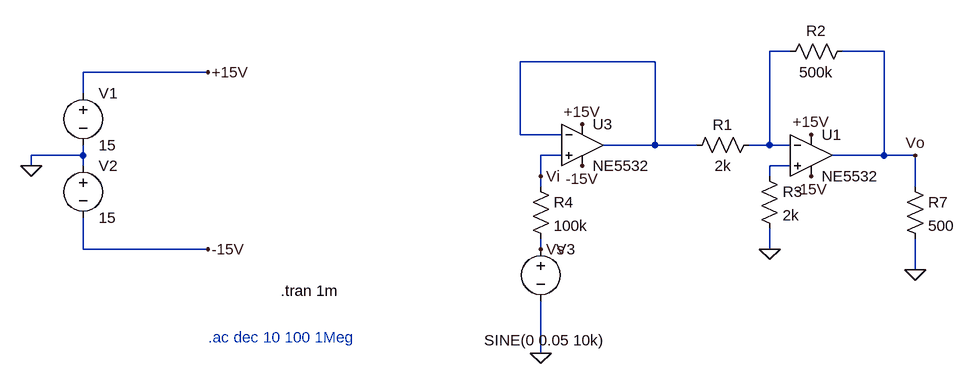
[diagram p0: schematic Class1高增益电压放大器.asc]
Class1高增益电压放大器.asc, the LTspice schematic file:
Version 4
SHEET 1 1668 680
WIRE 528 -16 496 -16
WIRE 672 -16 608 -16
WIRE 320 0 112 0
WIRE -368 16 -560 16
WIRE -560 48 -560 16
WIRE 112 112 112 0
WIRE 176 112 112 112
WIRE 320 128 320 0
WIRE 320 128 240 128
WIRE 384 128 320 128
WIRE 496 128 496 -16
WIRE 496 128 464 128
WIRE 528 128 496 128
WIRE -560 144 -560 128
WIRE -560 144 -640 144
WIRE 176 144 144 144
WIRE 672 144 672 -16
WIRE 672 144 592 144
WIRE 720 144 672 144
WIRE -640 160 -640 144
WIRE -560 160 -560 144
WIRE 528 160 496 160
WIRE 144 176 144 144
WIRE 496 176 496 160
WIRE 144 192 144 176
WIRE 720 192 720 144
WIRE -560 288 -560 240
WIRE -368 288 -560 288
WIRE 144 288 144 272
WIRE 496 288 496 256
WIRE 720 320 720 272
WIRE 144 448 144 368
FLAG -640 160 0
FLAG -368 16 +15V
FLAG -368 288 -15V
FLAG 560 112 +15V
FLAG 560 176 -15V
FLAG 496 288 0
FLAG 144 448 0
FLAG 208 160 -15V
FLAG 208 96 +15V
FLAG 720 320 0
FLAG 144 176 Vi
FLAG 720 144 Vo
FLAG 144 288 Vs
SYMBOL voltage -560 32 R0
SYMATTR InstName V1
SYMATTR Value 15
SYMBOL voltage -560 144 R0
SYMATTR InstName V2
SYMATTR Value 15
SYMBOL res 480 112 R90
WINDOW 0 0 56 VBottom 2
WINDOW 3 32 56 VTop 2
SYMATTR InstName R1
SYMATTR Value 2k
SYMBOL res 624 -32 R90
WINDOW 0 0 56 VBottom 2
WINDOW 3 32 56 VTop 2
SYMATTR InstName R2
SYMATTR Value 500k
SYMBOL res 480 160 R0
SYMATTR InstName R3
SYMATTR Value 2k
SYMBOL voltage 144 272 R0
WINDOW 3 -87 156 Left 2
WINDOW 123 -87 128 Left 2
WINDOW 39 24 44 Left 2
SYMATTR Value SINE(0 0.05 10k)
SYMATTR InstName V3
SYMBOL EXTRA\\AudioOpamp\\TI\\NE5532 208 128 R0
SYMATTR InstName U3
SYMBOL res 704 176 R0
SYMATTR InstName R7
SYMATTR Value 500
SYMBOL EXTRA\\AudioOpamp\\TI\\NE5532 560 144 R0
SYMATTR InstName U1
SYMBOL res 128 176 R0
SYMATTR InstName R4
SYMATTR Value 100k
TEXT -368 424 Left 2 ;.ac dec 10 100 1Meg
TEXT -256 352 Left 2 !.tran 1m

The netlist it stands for:
* Class1高增益电压放大器.asc
V1 +15V 0 15
V2 0 -15V 15
R1 N001 N002 2k
R2 Vo N001 500k
R3 N003 0 2k
V3 Vs 0 SINE(0 0.05 10k)
XU3 Vi N002 +15V -15V N002 NE5532  ; pins In+ In- V+ V- OUT
R7 Vo 0 500
XU1 N003 N001 +15V -15V Vo NE5532  ; pins In+ In- V+ V- OUT
R4 Vi Vs 100k
* .ac dec 10 100 1Meg
.tran 1m
.backanno
.end